# Altium schematic sheet Quad_DDS.SchDoc: Pounder
size 420 x 297 mm; Author: G.Kasprowicz; CompanyName: WUT ISE; DrawnBy: G.Kasprowicz; Organization: WUT ISE; Address1: PW ISE; Address2: Nowowiejska 15/19 00-665 Warsaw; Address3: gkasprow@gmail.com; DocumentNumber: 4; SheetNumber: 4; SheetTotal: 7; ModifiedBy: -; CheckedDate: -; Title2: Quad DDS & clocking; DivGrp: WUT ISE; Designer: G.Kasprowicz; ModifiedDate: -; ProjectName: Sensor Box
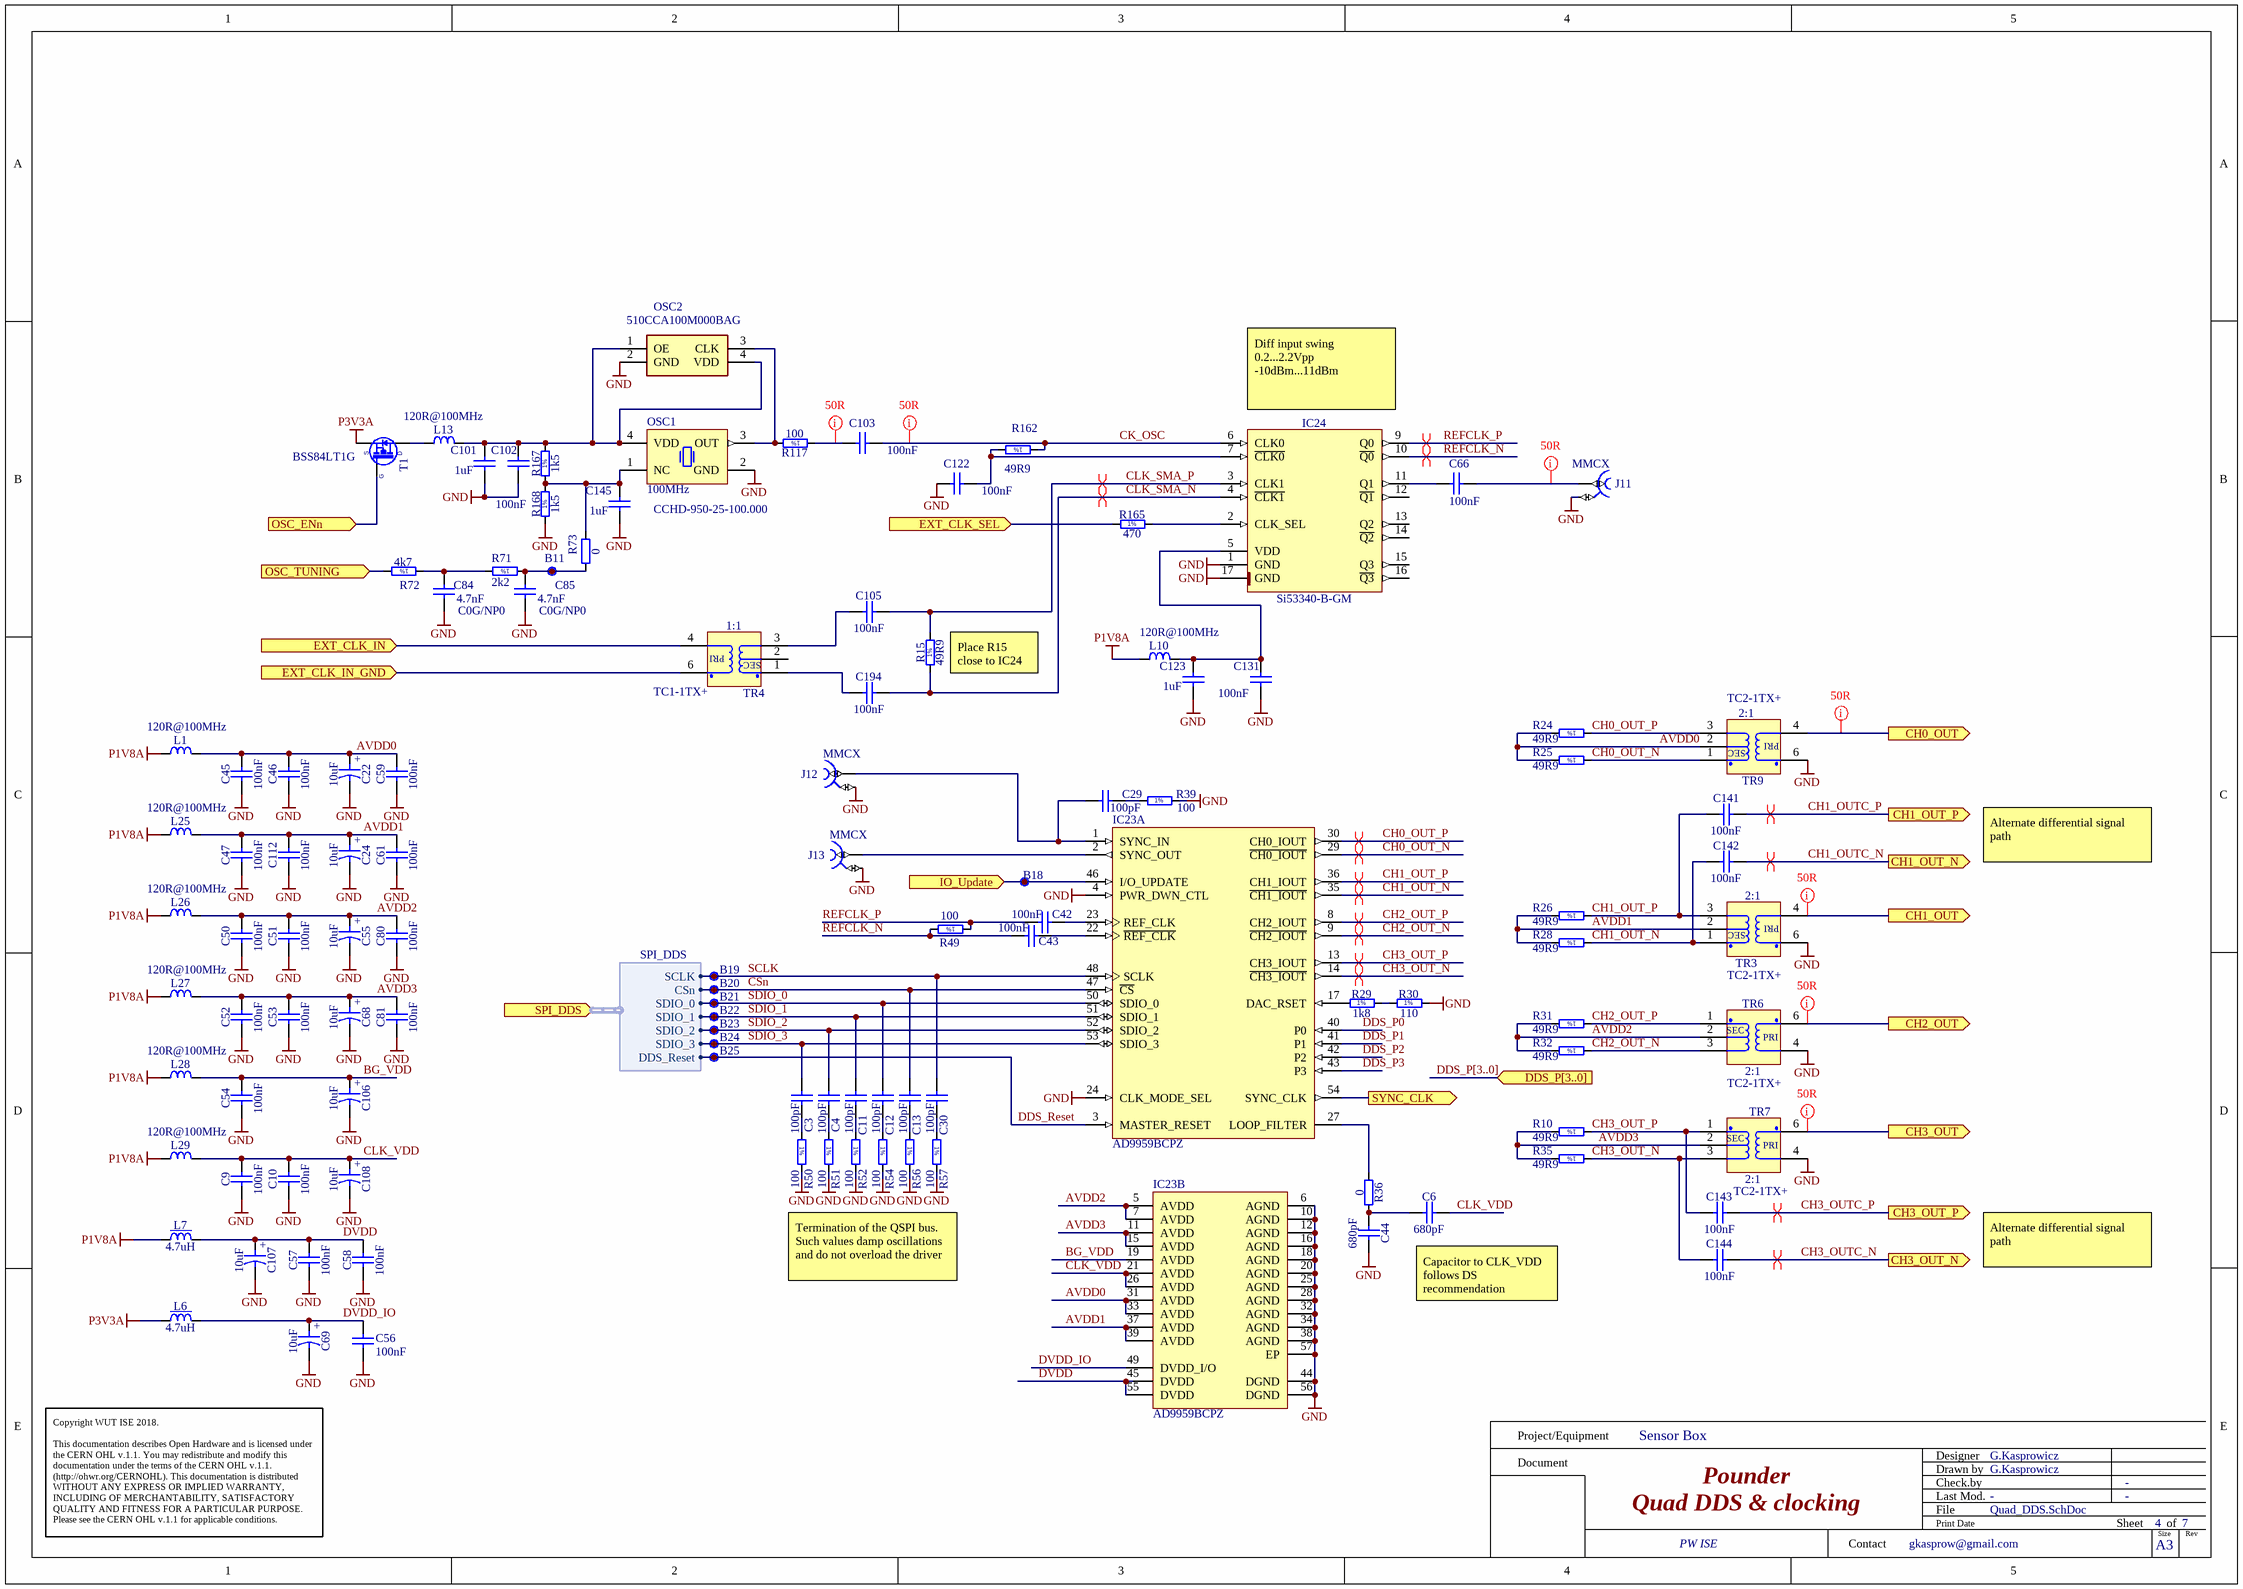
[diagram p0: Quad_DDS.SchDoc]

## Parts
B11  SMD Pad  [C100]  (value not drawn)
B18  SMD Pad  [C100]  (value not drawn)
B19  SMD Pad  [C100]  (value not drawn)
B20  SMD Pad  [C100]  (value not drawn)
B21  SMD Pad  [C100]  (value not drawn)
B22  SMD Pad  [C100]  (value not drawn)
B23  SMD Pad  [C100]  (value not drawn)
B24  SMD Pad  [C100]  (value not drawn)
B25  SMD Pad  [C100]  (value not drawn)
C3  100pF  [CAPC1005X55N]
C4  100pF  [CAPC1005X55N]
C6  680pF  [CAPC1608X87N]
C9  100nF  [CAPC1005X55N]
C10  100nF  [CAPC1005X55N]
C11  100pF  [CAPC1005X55N]
C12  100pF  [CAPC1005X55N]
C13  100pF  [CAPC1005X55N]
C22  10uF  [CAPMP3216X180N]
C24  10uF  [CAPMP3216X180N]
C29  100pF  [CAPC1005X55N]
C30  100pF  [CAPC1005X55N]
C42  100nF  [CAPC1005X55N]
C43  100nF  [CAPC1005X55N]
C44  680pF  [CAPC1608X87N]
C45  100nF  [CAPC1005X55N]
C46  100nF  [CAPC1005X55N]
C47  100nF  [CAPC1005X55N]
C50  100nF  [CAPC1005X55N]
C51  100nF  [CAPC1005X55N]
C52  100nF  [CAPC1005X55N]
C53  100nF  [CAPC1005X55N]
C54  100nF  [CAPC1005X55N]
C55  10uF  [CAPMP3216X180N]
C56  100nF  [CAPC1005X55N]
C57  100nF  [CAPC1005X55N]
C58  100nF  [CAPC1005X55N]
C59  100nF  [CAPC1005X55N]
C61  100nF  [CAPC1005X55N]
C66  100nF  [CAPC1005X55N]
C68  10uF  [CAPMP3216X180N]
C69  10uF  [CAPMP3216X180N]
C80  100nF  [CAPC1005X55N]
C81  100nF  [CAPC1005X55N]
C84  4.7nF  TC: C0G/NP0  [CAPC2012X95N]
C85  4.7nF  TC: C0G/NP0  [CAPC2012X95N]
C101  1uF  [CAPC1005X55N]
C102  100nF  [CAPC1005X55N]
C103  100nF  [CAPC1005X55N]
C105  100nF  [CAPC1005X55N]
C106  10uF  [CAPMP3216X180N]
C107  10uF  [CAPMP3216X180N]
C108  10uF  [CAPMP3216X180N]
C112  100nF  [CAPC1005X55N]
C122  100nF  [CAPC1005X55N]
C123  1uF  [CAPC1005X55N]
C131  100nF  [CAPC1005X55N]
C141  100nF  [CAPC1005X55N]
C142  100nF  [CAPC1005X55N]
C143  100nF  [CAPC1005X55N]
C144  100nF  [CAPC1005X55N]
C145  1uF  [CAPC1005X55N]
C194  100nF  [CAPC1005X55N]
IC23  AD9959BCPZ  [ADI-CP-56-1_M]  (parts A,B of 2)
IC24  Si53340-B-GM  [QFN50P300X300X90-17N-S175]
J11  MMCX  [Molex_73415-2063]
J12  MMCX  [Molex_73415-2063]
J13  MMCX  [Molex_73415-2063]
L1  120R@100MHz  [INDC1608X95N]
L6  4.7uH  [IND_WURTH_WE-TPC-2813]
L7  4.7uH  [IND_WURTH_WE-TPC-2813]
L10  120R@100MHz  [INDC1608X95N]
L13  120R@100MHz  [INDC1608X95N]
L25  120R@100MHz  [INDC1608X95N]
L26  120R@100MHz  [INDC1608X95N]
L27  120R@100MHz  [INDC1608X95N]
L28  120R@100MHz  [INDC1608X95N]
L29  120R@100MHz  [INDC1608X95N]
OSC1  100MHz  Manufacturer Part Number: CCHD-950-25-100.000  [OSC_CRYSTEK_CCHD-950]
OSC2  510CCA100M000BAG  [510CBA49M1520BAG]
R10  49R9  [RESC1005X40N]
R15  49R9  [RESC1005X40N]
R24  49R9  [RESC1005X40N]
R25  49R9  [RESC1005X40N]
R26  49R9  [RESC1005X40N]
R28  49R9  [RESC1005X40N]
R29  1k8  [RESC1608X55N]
R30  110  [RESC1005X40N]
R31  49R9  [RESC1005X40N]
R32  49R9  [RESC1005X40N]
R35  49R9  [RESC1005X40N]
R36  0  [RESC1608X55N]
R39  100  [RESC1005X40N]
R49  100  [RESC1005X40N]
R50  100  [RESC1005X40N]
R51  100  [RESC1005X40N]
R52  100  [RESC1005X40N]
R54  100  [RESC1005X40N]
R56  100  [RESC1005X40N]
R57  100  [RESC1005X40N]
R71  2k2  [RESC1608X55N]
R72  4k7  [RESC1608X55N]
R73  0  [RESC1608X55N]
R117  100  [RESC1005X40N]
R162  49R9  [RESC1005X40N]
R165  470  [RESC1005X40N]
R167  1k5  [RESC1608X55N]
R168  1k5  [RESC1608X55N]
T1  BSS84LT1G  [SOT95P240X110-3N]
TR3  2:1  Manufacturer Part Number: TC2-1TX+  [XFMR_MINI-CIRCUITS_AT1521]
TR4  1:1  Manufacturer Part Number: TC1-1TX+  [XFMR_MINI-CIRCUITS_AT1521]
TR6  2:1  Manufacturer Part Number: TC2-1TX+  [XFMR_MINI-CIRCUITS_AT1521]
TR7  2:1  Manufacturer Part Number: TC2-1TX+  [XFMR_MINI-CIRCUITS_AT1521]
TR9  2:1  Manufacturer Part Number: TC2-1TX+  [XFMR_MINI-CIRCUITS_AT1521]

## Ports
CH0_OUT (out), CH1_OUT (out), CH1_OUT_N (out), CH1_OUT_P (out), CH2_OUT (out), CH3_OUT (out), CH3_OUT_N (out), CH3_OUT_P (out), DDS_P[3..0] (in), EXT_CLK_IN (in), EXT_CLK_IN_GND (in), EXT_CLK_SEL (in), IO_Update (in), OSC_ENn (in), OSC_TUNING (in), SPI_DDS (in, harness SPI_DDS), SYNC_CLK (out)

## Harnesses
SPI_DDS: SCLK, CSn, SDIO_0, SDIO_1, SDIO_2, SDIO_3, DDS_Reset

## Nets
GND: C9.1 C10.1 C22.2 C24.2 C44.2 C45.1 C46.1 C47.1 C50.1 C51.1 C52.1 C53.1 C54.1 C55.2 C56.1 C57.1 C58.1 C59.1 C61.1 C68.2 C69.2 C80.1 C81.1 C84.1 C85.1 C101.1 C102.1 C106.2 C107.2 C108.2 C112.1 C122.2 C123.1 C131.1 C145.1 IC23.4(PWR_DWN_CTL) IC23.6(AGND) IC23.10(AGND) IC23.12(AGND) IC23.16(AGND) IC23.18(AGND) IC23.20(AGND) IC23.24(CLK_MODE_SEL) IC23.25(AGND) IC23.28(AGND) IC23.32(AGND) IC23.34(AGND) IC23.38(AGND) IC23.44(DGND) IC23.56(DGND) IC23.57(EP) IC24.1(GND) IC24.17(GND) J11.2 J12.2 J13.2 OSC1.2(GND) OSC2.2(GND) R30.2 R39.2 R50.2 R51.2 R52.2 R54.2 R56.2 R57.2 R168.1 TR3.6(PDOT) TR6.4(P) TR7.4(P) TR9.6(PDOT)
P1V8A: L1.2 L7.1 L10.2 L25.2 L26.2 L27.2 L28.2 L29.2
P3V3A: L6.1 T1.2(S)
AVDD0: C22.1 C45.2 C46.2 C59.2 IC23.31(AVDD) IC23.33(AVDD) L1.1 R24.2 R25.2 TR9.2(NC)
AVDD1: C24.1 C47.2 C61.2 C112.2 IC23.37(AVDD) IC23.39(AVDD) L25.1 R26.2 R28.2 TR3.2(NC)
AVDD2: C50.2 C51.2 C55.1 C80.2 IC23.5(AVDD) IC23.7(AVDD) L26.1 R31.2 R32.2 TR6.2(NC)
AVDD3: C52.2 C53.2 C68.1 C81.2 IC23.11(AVDD) IC23.15(AVDD) L27.1 R10.2 R35.2 TR7.2(NC)
BG_VDD: C54.2 C106.1 IC23.19(AVDD) L28.1
CH0_OUT: TR9.4(P) ; port CH0_OUT
CH0_OUT_N: IC23.29(~{CH0_IOUT}) R25.1 TR9.1(SDOT)
CH0_OUT_P: IC23.30(CH0_IOUT) R24.1 TR9.3(S)
CH1_OUT: TR3.4(P) ; port CH1_OUT
CH1_OUT_N: C142.1 IC23.35(~{CH1_IOUT}) R28.1 TR3.1(SDOT)
CH1_OUT_P: C141.1 IC23.36(CH1_IOUT) R26.1 TR3.3(S)
CH1_OUTC_N: C142.2 ; port CH1_OUT_N
CH1_OUTC_P: C141.2 ; port CH1_OUT_P
CH2_OUT: TR6.6(PDOT) ; port CH2_OUT
CH2_OUT_N: IC23.9(~{CH2_IOUT}) R32.1 TR6.3(S)
CH2_OUT_P: IC23.8(CH2_IOUT) R31.1 TR6.1(SDOT)
CH3_OUT: TR7.6(PDOT) ; port CH3_OUT
CH3_OUT_N: C144.1 IC23.14(~{CH3_IOUT}) R35.1 TR7.3(S)
CH3_OUT_P: C143.1 IC23.13(CH3_IOUT) R10.1 TR7.1(SDOT)
CH3_OUTC_N: C144.2 ; port CH3_OUT_N
CH3_OUTC_P: C143.2 ; port CH3_OUT_P
CK_OSC: C103.1 IC24.6(CLK0) R162.1
CLK_SMA_N: C194.2 IC24.4(~{CLK1}) R15.1
CLK_SMA_P: C105.2 IC24.3(CLK1) R15.2
CLK_VDD: C6.2 C9.2 C10.2 C108.1 IC23.21(AVDD) IC23.26(AVDD) L29.1
CSn: B20.1 C13.2 IC23.47(~{CS}) ; port SPI_DDS.CSn
DDS_P0: IC23.40(P0)
DDS_P1: IC23.41(P1)
DDS_P2: IC23.42(P2)
DDS_P3: IC23.43(P3)
DDS_Reset: B25.1 IC23.3(MASTER_RESET) ; port SPI_DDS.DDS_Reset
DVDD: C57.2 C58.2 C107.1 IC23.45(DVDD) IC23.55(DVDD) L7.2
DVDD_IO: C56.2 C69.1 IC23.49(DVDD_I/O) L6.2
EXT_CLK_IN: TR4.4(P) ; port EXT_CLK_IN
EXT_CLK_IN_GND: TR4.6(PDOT) ; port EXT_CLK_IN_GND
EXT_CLK_SEL: R165.1 ; port EXT_CLK_SEL
IO_Update: B18.1 IC23.46(I/O_UPDATE) ; port IO_Update
OSC_ENn: T1.1(G) ; port OSC_ENn
OSC_TUNING: R72.2 ; port OSC_TUNING
REFCLK_N: C43.2 IC24.10(~{Q0}) R49.2
REFCLK_P: C42.2 IC24.9(Q0) R49.1
SCLK: B19.1 C30.2 IC23.48(SCLK) ; port SPI_DDS.SCLK
SDIO_0: B21.1 C12.2 IC23.50(SDIO_0) ; port SPI_DDS.SDIO_0
SDIO_1: B22.1 C11.2 IC23.51(SDIO_1) ; port SPI_DDS.SDIO_1
SDIO_2: B23.1 C4.2 IC23.52(SDIO_2) ; port SPI_DDS.SDIO_2
SDIO_3: B24.1 C3.2 IC23.53(SDIO_3) ; port SPI_DDS.SDIO_3
SYNC_CLK: IC23.54(SYNC_CLK) ; port SYNC_CLK
NetB11_1: B11.1 C85.2 R71.1 R73.1
NetC3_1: C3.1 R50.1
NetC4_1: C4.1 R51.1
NetC6_1: C6.1 C44.1 R36.2
NetC11_1: C11.1 R52.1
NetC12_1: C12.1 R54.1
NetC13_1: C13.1 R56.1
NetC29_1: C29.1 R39.1
NetC29_2: C29.2 IC23.1(SYNC_IN) J12.1
NetC30_1: C30.1 R57.1
NetC42_1: C42.1 IC23.23(REF_CLK)
NetC43_1: C43.1 IC23.22(~{REF_CLK})
NetC66_1: C66.1 J11.1
NetC66_2: C66.2 IC24.11(Q1)
NetC84_2: C84.2 R71.2 R72.1
NetC101_2: C101.2 C102.2 L13.1 OSC1.4(VDD) OSC2.1(OE) OSC2.4(VDD) R167.2
NetC103_2: C103.2 R117.1
NetC105_1: C105.1 TR4.3(S)
NetC122_1: C122.1 IC24.7(~{CLK0}) R162.2
NetC123_2: C123.2 C131.2 IC24.5(VDD) L10.1
NetC145_2: C145.2 OSC1.1(NC) R73.2 R167.1 R168.2
NetC194_1: C194.1 TR4.1(SDOT)
NetIC23_2: IC23.2(SYNC_OUT) J13.1
NetIC23_17: IC23.17(DAC_RSET) R29.1
NetIC23_27: IC23.27(LOOP_FILTER) R36.1
NetIC24_2: IC24.2(CLK_SEL) R165.2
NetL13_2: L13.2 T1.3(D)
NetOSC1_3: OSC1.3(OUT) OSC2.3(CLK) R117.2
NetR29_2: R29.2 R30.1

Not connected (* = marked no-connect by the designer): IC24 12(~{Q1}) 13(Q2) 14(~{Q2}) 15(Q3) 16(~{Q3}); TR4 2(NC)

## Buses and harness runs
bus DDS_P[3..0] = port DDS_P[3..0]

## Layout directives
differential pair: CH0_OUT_N, CH0_OUT_P, CH1_OUT_N, CH1_OUT_P, CH1_OUTC_N, CH1_OUTC_P, CH2_OUT_N, CH2_OUT_P, CH3_OUT_N, CH3_OUT_P, CH3_OUTC_N, CH3_OUTC_P, CLK_SMA_N, CLK_SMA_P, REFCLK_N, REFCLK_P
net class Z50R: CH0_OUT, CH1_OUT, CH2_OUT, CH3_OUT, CK_OSC, NetC66_1, NetC103_2

## Notes on the sheet
- (near IC24) Diff input swing
  0.2...2.2Vpp
  -10dBm...11dBm
- (near R15) Place R15 close to IC24
- Alternate differential signal path
- Termination of the QSPI bus. Such values damp oscillations and do not overload the driver
- Capacitor to CLK_VDD follows DS recommendation
- Project/Equipment
- Document
- Designer
- Drawn by
- Check.by
- Copyright WUT ISE 2018.
  This documentation describes Open Hardware and is licensed under the CERN OHL v.1.1. You may redistribute and modify this documentation under the terms of the CERN OHL v.1.1. (http://ohwr.org/CERNOHL). This documentation is distributed WITHOUT ANY EXPRESS OR IMPLIED WARRANTY, INCLUDING OF MERCHANTABILITY, SATISFACTORY QUALITY AND FITNESS FOR A PARTICULAR PURPOSE. Please see the CERN OHL v.1.1 for applicable conditions.
- Contact
- File
- Last Mod.
- Print Date
- Sheet
- Size
- A3
- of
- Rev
- (in symbol CTE3216-18_10UF_16V_20%_AVX_TCJ) +
- (in symbol R0402_49R9_1%_0.0625W_100PPM) 1%
- (in symbol R0402_100R_1%_0.0625W_100PPM) 1%
- (in symbol R0402_110R_1%_0.0625W_100PPM) 1%
- (in symbol R0402_470R_1%_0.0625W_100PPM) 1%
- (in symbol R0603_1K5_1%_0.1W_100PPM) 1%
- (in symbol R0603_1K8_1%_0.1W_100PPM) 1%
- (in symbol R0603_2K2_1%_0.1W_100PPM) 1%
- (in symbol R0603_4K7_1%_0.1W_100PPM) 1%
- (in symbol XFMR_MINI-CIRCUITS_TC1-1TX+) PRI; SEC
- (in symbol XFMR_MINI-CIRCUITS_TC2-1TX+) PRI; SEC

## Library data of the parts
B11 B18-B25 = SMD_PAD_D1MM: Through Hole Pad; Part Description: 1mm Diameter SMD Pad; Mounted: No; Part Number: SMD_PAD_D1MM; Component Kind: Standard (No BOM); Component Type: Standard (No BOM); Pin Count: 1; Family: SMD Pad; Socket: No; SMD: No; Sense: No; Status: None; ComponentHeight: 0mm; HelpURL: Undefined; Author: CERN DEM JLC; CreateDate: 10.10.2017; LatestRevisionDate: 10.10.2017; PackageDescription: 1mm Diameter SMD Pad
C3 C4 C11-C13 C29 C30 = CC0402_100PF_50V_5%_C0G: Non-polarised capacitor; Part Description: SMD Multilayer Chip Ceramic Capacitor; Manufacturer: GENERIC; Manufacturer1 Part Number: C0402C101J5GACTU; Voltage: 50V; TC: C0G/NP0; Tolerance: ±5%; Part Number: CC0402_100PF_50V_5%_C0G; Component Kind: Standard; Component Type: Standard; Pin Count: 2; Value: 100pF; Status: Preferred; Manufacturer Part Number: CC0402_100PF_50V_5%_C0G; Case: 0402; Mounted: Yes; Socket: No; SMD: Yes; Sense: No; Manufacturer1 Example: KEMET; Manufacturer1 ComponentHeight: 0.55mm; HelpURL: \\cern.ch\dfs\Applications\Altium\Datasheets\CC0805_C0G_KEMET_(Commercial Grade).pdf; Author: CERN DEM JLC; CreateDate: 03.12.2007; LatestRevisionDate: 22.04.2015
C6 C44 = CC0603_680PF_50V_5%_NP0: Non-polarised capacitor; Part Description: SMD Multilayer Chip Ceramic Capacitor; Manufacturer: GENERIC; Manufacturer1 Part Number: 223886715681; Voltage: 50V; TC: C0G/NP0; Tolerance: ±5%; Part Number: CC0603_680PF_50V_5%_NP0; Component Kind: Standard; Component Type: Standard; Pin Count: 2; Value: 680pF; Status: Preferred; Manufacturer Part Number: CC0603_680PF_50V_5%_NP0; Case: 0603; Mounted: Yes; Socket: No; SMD: Yes; Sense: No; Manufacturer1 ComponentHeight: 0.87mm; HelpURL: \\cern.ch\dfs\Applications\Altium\Datasheets\CC0603_NP0_PHYCOMP.pdf; Author: CERN DEM JLC; CreateDate: 03.12.2007; LatestRevisionDate: 03.12.2007; Manufacturer1 Example: PHYCOMP
C9 C10 C42 C43 C45-C47 C50-C54 C56-C59 C61 C66 C80 C81 C102 C103 C105 C112 C122 C131 C141-C144 C194 = CC0402_100NF_16V_10%_X5R: Non-polarised capacitor; Part Description: SMD Multilayer Chip Ceramic Capacitor; Manufacturer: GENERIC; Manufacturer1 Part Number: GRM155R61C104KA88D; Voltage: 16V; TC: X5R; Tolerance: ±10%; Part Number: CC0402_100NF_16V_10%_X5R; Component Kind: Standard; Component Type: Standard; Pin Count: 2; Value: 100nF; Status: None; Manufacturer Part Number: CC0402_100NF_16V_10%_X5R; Case: 0402; Mounted: Yes; Socket: No; SMD: Yes; Sense: No; Manufacturer1 Example: MURATA; Manufacturer1 ComponentHeight: 0.55mm; HelpURL: \\cern.ch\dfs\Applications\Altium\Datasheets\CC0402_X5R_MURATA_GRM.pdf; Author: CERN DEM JLC; CreateDate: 10.12.2013; LatestRevisionDate: 10.12.2013
C22 C24 C55 C68 C69 C106-C108 = CTE3216-18_10UF_16V_20%_AVX_TCJ: Polarised capacitor; Part Description: ESR 0R200 Tantalum Solid Electrolytic Chip Capacitor with Conductive Polymer Electrode; Manufacturer: AVX; Manufacturer Part Number: TCJA106M016R0200; Voltage: 16V; Tolerance: ±20%; Part Number: CTE3216-18_10UF_16V_20%_AVX_TCJ; Component Kind: Standard; Component Type: Standard; Pin Count: 2; Value: 10uF; Status: Preferred; Case: A; Mounted: Yes; Socket: No; SMD: Yes; Sense: No; ComponentHeight: 1.8mm; HelpURL: \\cern.ch\dfs\Applications\Altium\Datasheets\CTE_AVX_TCJ.pdf; Author: CERN DEM JLC; CreateDate: 29.03.2012; LatestRevisionDate: 29.03.2012
C84 C85 = CC0805_4.7NF_50V_5%_NP0: Non-polarised capacitor; Part Description: SMD Multilayer Chip Ceramic Capacitor; Manufacturer: GENERIC; Manufacturer1 Part Number: GRM2195C1H472JA01; Voltage: 50V; Tolerance: ±5%; Part Number: CC0805_4.7NF_50V_5%_NP0; Component Kind: Standard; Component Type: Standard; Pin Count: 2; Value: 4.7nF; Status: None; Manufacturer Part Number: CC0805_4.7NF_50V_5%_NP0; Case: 0805; Mounted: Yes; Socket: No; SMD: Yes; Sense: No; Manufacturer1 Example: MURATA; Manufacturer1 ComponentHeight: 0.95mm; HelpURL: \\cern.ch\dfs\Applications\Altium\Datasheets\CC0805_MURATA_GRM2195C1H472JA01.pdf; Author: CERN DEM MR; CreateDate: 30.03.2016; LatestRevisionDate: 30.03.2016
C101 C123 C145 = CC0402_1UF_16V_10%_X5R: Non-polarised capacitor; Part Description: SMD Multilayer Chip Ceramic Capacitor; Manufacturer: GENERIC; Manufacturer1 Part Number: C1005X5R1C105KT; Voltage: 16V; TC: X5R; Tolerance: ±10%; Part Number: CC0402_1UF_16V_10%_X5R; Component Kind: Standard; Component Type: Standard; Pin Count: 2; Value: 1uF; Status: Preferred; Manufacturer Part Number: CC0402_1UF_16V_10%_X5R; Case: 0402; Mounted: Yes; Socket: No; SMD: Yes; Sense: No; Manufacturer1 Example: TDK; Manufacturer1 ComponentHeight: 0.55mm; HelpURL: \\cern.ch\dfs\Applications\Altium\Datasheets\CC0402_X5R_TDK_C.pdf; Author: CERN DEM JLC; CreateDate: 2012-10-25; LatestRevisionDate: 2012-10-25
IC23 = CMP-0293-00014-1: 4-Channel, 500 MSPS DDS with 10-Bit DACs, Serial, CP-56-1, 260 Tray, Pb-Free; Tuning Word Width (bits): 32bit; Master fclk: 500MHz; Compliance Range (V): 2.3V; FS Iout (mA nom): 10mA; REFCLK Multiplier: Yes; I Supply total (max): 180mA; Resolution (Bits): 10bit; ComponentLink3URL: http://www.analog.com/static/imported-files/packages/32698137492825CP_56_1.pdf; PackageDescription: 56-Lead Lead Frame Chip Scale Package [LFCSP_VQ]; DatasheetVersion: Rev. B; ComponentLink1URL: www.analog.com; PackageVersion: 112805-0; ComponentLink1Description: Manufacturer URL; ComponentLink2Description: Datasheet; Code_JEDEC: MO-220-VLLD-2; ComponentLink2URL: http://www.analog.com/static/imported-files/data_sheets/AD9959.pdf; PackageReference: CP-56-1; I/O Interface: Serial; ComponentLink3Description: Package Specification
IC24 = Si53340-B-GM: Low-Jitter LVDS Fanout Clock Buffers, 10-Output,  Any-Input, Any-Frequency up to 1250MHz; Manufacturer: SILICON LABS; PressFit: No; Bonding: No; Part Number: Si53340-B-GM; Component Kind: Standard; Component Type: Standard; Device: Si53340-B-GM; PackageDescription: QFN, 0.50mm Pitch, Square; 16 Pin, 3.00mm L X 3.00mm W X 0.90mm H Body (w/thermal tab 1.75mm x 1.75mm), IPC Medium Density; Part Description: Low-Jitter LVDS Fanout Clock Buffers, 10-Output,  Any-Input, Any-Frequency up to 1250MHz; Manufacturer Part Number: Si53340-B-GM; Pin Count: 17; Case: QFN16; Mounted: Yes; Socket: No; SMD: Yes; Sense: No; ComponentHeight: 0.9mm; HelpURL: \\cern.ch\dfs\Applications\Altium\Datasheets\Si53340-B-GM.pdf; Author: CERN DEM MR; CreateDate: 04.09.2017; LatestRevisionDate: 04.09.2017
J11-J13 = CON_RF_MMCX_SMT: SMT MMCX connector; Part Description: Straight Through-hole 50 Ohm Micro Mini RF Jack, MMCX Series; Manufacturer: Molex; Manufacturer Part Number: 73415-2063; PressFit: No; Component Kind: Standard; Component Type: Standard; Pin Count: 2; Mounted: Yes; Socket: No; Sense: No; SMD: No; Status: None; ComponentHeight: 4.35mm; HelpURL: \\cern.ch\dfs\Applications\Altium\Datasheets\SAMTEC_MMCX-J-P-H-ST-TH1.pdf; Author: GK; CreateDate: 05.12.2012; LatestRevisionDate: 05.12.2012; Part Number: 73415-2063
L1 L10 L13 L25-L29 = IND0603_MURATA_BLM18PG121SN1D: Inductor; Part Description: SMD EMIFIL Chip Ferrite Bead; Manufacturer: MURATA; Power: 2A; Resistance: 0.05R; Part Number: IND0603_MURATA_BLM18PG121SN1D; Component Kind: Standard; Component Type: Standard; Pin Count: 2; Value: 120R@100MHz; Status: None; Manufacturer Part Number: BLM18PG121SN1D; Case: 0603; Mounted: Yes; Socket: No; SMD: Yes; Sense: No; ComponentHeight: 0.95mm; HelpURL: \\cern.ch\dfs\Applications\Altium\Datasheets\IND0603_MURATA_BLM18P.pdf; Author: CERN DEM BC; CreateDate: 2015-07-27; LatestRevisionDate: 2015-07-27
L6 L7 = IND_4.7UH_30%_WURTH_WE-TPC_744029004: Inductor With Core; Part Description: Shielded Tiny Power Inductor (WE-TPC Series); Manufacturer: WURTH ELEKTRONIK; Power: 1A; Resistance: 0.017R; Tolerance: ±30%; Part Number: IND_4.7UH_30%_WURTH_WE-TPC_744029004; Component Kind: Standard; Component Type: Standard; Pin Count: 2; Value: 4.7uH; Status: None; Manufacturer Part Number: 744029004; Mounted: Yes; Socket: No; SMD: Yes; Sense: No; ComponentHeight: 3mm; HelpURL: \\cern.ch\dfs\Applications\Altium\Datasheets\IND_WURTH_WE-TPC_744029004.pdf; Author: CERN DEM JLC; CreateDate: 20.11.2014; LatestRevisionDate: 20.11.2014
OSC1 = OSC_CCHD-950: 100MHz low noise oscillator; Part Number: OSC_100MHZ_CRYSTEK_CCHD-950-25-100.000; Part Description: 3.3V, ±25ppm, 0..70°C, CMOS Surface Mount Ultra-Low Noise Oscillator (CCHD-950 Series); Manufacturer: CRYSTEK CRYSTAL; PressFit: No; Bonding: No; Component Kind: Standard; Component Type: Standard; PackageDescription: Oscillator, 5.08mm Pitch; 4 Pin, 14.2mm L X 9.14mm W X 5.3mm H, CCHD-950 Serie; Value: 100MHz; Pin Count: 4; Mounted: Yes; Socket: No; SMD: Yes; Sense: No; ComponentHeight: 5.3mm; HelpURL: \\cern.ch\dfs\Applications\Altium\Datasheets\OSC_CRYSTEK_CVHD-950.pdf; Author: GK; CreateDate: 04.11.2016; LatestRevisionDate: 04.11.2016
OSC2 = 510CCA100M000BAG: Crystal or Oscillator; Manufacturer_Name: Silicon Labs; Datasheet Link: https://www.silabs.com/documents/public/data-sheets/si510-11.pdf; Height: 1mm; Manufacturer_Part_Number: 510CCA100M000BAG; Mouser Part Number: 634-510CCA100M000BAG; Mouser Price/Stock: https://www.mouser.com/Search/Refine.aspx?Keyword=634-510CCA100M000BAG
R10 R15 R24-R26 R28 R31 R32 R35 R162 = R0402_49R9_1%_0.0625W_100PPM: Resistor - 1%; Part Description: General Purpose Thick Film Chip Resistor; Manufacturer: GENERIC; Manufacturer1 Part Number: 232270674999L or RC0402FR-0749R9L; TC: ±100ppm/°C; PressFit: No; Part Number: R0402_49R9_1%_0.0625W_100PPM; Component Kind: Standard; Component Type: Standard; Pin Count: 2; Value: 49R9; Status: Not Recommended; Power: 0.0625W; Tolerance: ±1%; Manufacturer Part Number: R0402_49R9_1%_0.0625W_100PPM; Case: 0402; Mounted: Yes; Sense: No; Socket: No; SMD: Yes; Manufacturer1 Example: YAGEO PHYCOMP; Manufacturer1 ComponentHeight: 0.4mm; HelpURL: \\cern.ch\dfs\Applications\Altium\Datasheets\R0402_Phycomp_RC0402.pdf; Author: CERN DEM JLC; CreateDate: 24.10.2012; LatestRevisionDate: 24.10.2012
R29 = R0603_1K8_1%_0.1W_100PPM: Resistor - 1%; Part Description: General Purpose Thick Film Chip Resistor; Manufacturer: GENERIC; Manufacturer1 Part Number: NRC06F1801TRF; Power: 0.1W; TC: ±100ppm/°C; PressFit: No; Part Number: R0603_1K8_1%_0.1W_100PPM; Component Kind: Standard; Component Type: Standard; Pin Count: 2; Value: 1k8; Status: Preferred; Tolerance: ±1%; Manufacturer Part Number: R0603_1K8_1%_0.1W_100PPM; Case: 0603; Mounted: Yes; Sense: No; Socket: No; SMD: Yes; Manufacturer1 Example: NIC COMPONENT; Manufacturer1 ComponentHeight: 0.55mm; HelpURL: \\cern.ch\dfs\Applications\Altium\Datasheets\R0603_NIC_NRC.pdf; Author: CERN DEM JLC; CreateDate: 03.12.2007; LatestRevisionDate: 13.03.2008
R30 = R0402_110R_1%_0.0625W_100PPM: Resistor - 1%; Part Description: General Purpose Thick Film Chip Resistor; Manufacturer: GENERIC; Manufacturer1 Part Number: 232270671101L; TC: ±100ppm/°C; PressFit: No; Part Number: R0402_110R_1%_0.0625W_100PPM; Component Kind: Standard; Component Type: Standard; Pin Count: 2; Value: 110; Status: Not Recommended; Power: 0.0625W; Tolerance: ±1%; Manufacturer Part Number: R0402_110R_1%_0.0625W_100PPM; Case: 0402; Mounted: Yes; Sense: No; Socket: No; SMD: Yes; Manufacturer1 Example: YAGEO PHYCOMP; Manufacturer1 ComponentHeight: 0.4mm; HelpURL: \\cern.ch\dfs\Applications\Altium\Datasheets\R0402_Phycomp_RC0402.pdf; Author: CERN DEM JLC; CreateDate: 03.12.2007; LatestRevisionDate: 17.10.2012
R36 R73 = R0603_0R_JUMPER: Resistor; Part Description: 1A (0.05R Max DC Resistance) Zero Ohm Jumper; Manufacturer: GENERIC; Manufacturer1 Part Number: NRC06Z0; PressFit: No; Part Number: R0603_0R_JUMPER; Component Kind: Standard; Component Type: Standard; Pin Count: 2; Value: 0; Status: Preferred; Manufacturer Part Number: R0603_0R_JUMPER; Case: 0603; Mounted: Yes; Sense: No; Socket: No; SMD: Yes; Manufacturer1 Example: NIC COMPONENT; Manufacturer1 ComponentHeight: 0.55mm; HelpURL: \\cern.ch\dfs\Applications\Altium\Datasheets\R0603_NIC_NRC.pdf; Author: CERN DEM JLC; CreateDate: 03/12/2007; LatestRevisionDate: 13/03/2008
R39 R49-R52 R54 R56 R57 R117 = R0402_100R_1%_0.0625W_100PPM: Resistor - 1%; Part Description: General Purpose Thick Film Chip Resistor; Manufacturer: GENERIC; Manufacturer1 Part Number: 232270671001L; TC: ±100ppm/°C; PressFit: No; Part Number: R0402_100R_1%_0.0625W_100PPM; Component Kind: Standard; Component Type: Standard; Pin Count: 2; Value: 100; Status: Not Recommended; Power: 0.0625W; Tolerance: ±1%; Manufacturer Part Number: R0402_100R_1%_0.0625W_100PPM; Case: 0402; Mounted: Yes; Sense: No; Socket: No; SMD: Yes; Manufacturer1 Example: YAGEO PHYCOMP; Manufacturer1 ComponentHeight: 0.4mm; HelpURL: \\cern.ch\dfs\Applications\Altium\Datasheets\R0402_Phycomp_RC0402.pdf; Author: CERN DEM JLC; CreateDate: 03.12.2007; LatestRevisionDate: 17.10.2012
R71 = R0603_2K2_1%_0.1W_100PPM: Resistor - 1%; Part Description: General Purpose Thick Film Chip Resistor; Manufacturer: GENERIC; Manufacturer1 Part Number: NRC06F2201TRF; Power: 0.1W; TC: ±100ppm/°C; Part Number: R0603_2K2_1%_0.1W_100PPM; Component Kind: Standard; Component Type: Standard; Pin Count: 2; Value: 2k2; Status: Preferred; Tolerance: ±1%; Manufacturer Part Number: R0603_2K2_1%_0.1W_100PPM; Case: 0603; Mounted: Yes; Sense: No; Socket: No; SMD: Yes; Manufacturer1 Example: NIC COMPONENT; Manufacturer1 ComponentHeight: 0.55mm; HelpURL: \\cern.ch\dfs\Applications\Altium\Datasheets\R0603_NIC_NRC.pdf; Author: CERN DEM JLC; CreateDate: 03.12.2007; LatestRevisionDate: 13.03.2008
R72 = R0603_4K7_1%_0.1W_100PPM: Resistor - 1%; Part Description: General Purpose Thick Film Chip Resistor; Manufacturer: GENERIC; Manufacturer1 Part Number: NRC06F4701TRF; Power: 0.1W; TC: ±100ppm/°C; PressFit: No; Part Number: R0603_4K7_1%_0.1W_100PPM; Component Kind: Standard; Component Type: Standard; Pin Count: 2; Value: 4k7; Status: Preferred; Tolerance: ±1%; Manufacturer Part Number: R0603_4K7_1%_0.1W_100PPM; Case: 0603; Mounted: Yes; Sense: No; Socket: No; SMD: Yes; Manufacturer1 Example: NIC COMPONENT; Manufacturer1 ComponentHeight: 0.55mm; HelpURL: \\cern.ch\dfs\Applications\Altium\Datasheets\R0603_NIC_NRC.pdf; Author: CERN DEM JLC; CreateDate: 03.12.2007; LatestRevisionDate: 13.03.2008
R165 = R0402_470R_1%_0.0625W_100PPM: Resistor - 1%; Part Description: General Purpose Thick Film Chip Resistor; Manufacturer: GENERIC; Manufacturer1 Part Number: 232270674701L; TC: ±100ppm/°C; PressFit: No; Part Number: R0402_470R_1%_0.0625W_100PPM; Component Kind: Standard; Component Type: Standard; Pin Count: 2; Value: 470; Status: Not Recommended; Power: 0.0625W; Tolerance: ±1%; Manufacturer Part Number: R0402_470R_1%_0.0625W_100PPM; Case: 0402; Mounted: Yes; Sense: No; Socket: No; SMD: Yes; Manufacturer1 Example: YAGEO PHYCOMP; Manufacturer1 ComponentHeight: 0.4mm; HelpURL: \\cern.ch\dfs\Applications\Altium\Datasheets\R0402_Phycomp_RC0402.pdf; Author: CERN DEM JLC; CreateDate: 03.12.2007; LatestRevisionDate: 17.10.2012
R167 R168 = R0603_1K5_1%_0.1W_100PPM: Resistor - 1%; Part Description: General Purpose Thick Film Chip Resistor; Manufacturer: GENERIC; Manufacturer1 Part Number: NRC06F1501TRF; Power: 0.1W; TC: ±100ppm/°C; PressFit: No; Part Number: R0603_1K5_1%_0.1W_100PPM; Component Kind: Standard; Component Type: Standard; Pin Count: 2; Value: 1k5; Status: Preferred; Tolerance: ±1%; Manufacturer Part Number: R0603_1K5_1%_0.1W_100PPM; Case: 0603; Mounted: Yes; Sense: No; Socket: No; SMD: Yes; Manufacturer1 Example: NIC COMPONENT; Manufacturer1 ComponentHeight: 0.55mm; HelpURL: \\cern.ch\dfs\Applications\Altium\Datasheets\R0603_NIC_NRC.pdf; Author: CERN DEM JLC; CreateDate: 03.12.2007; LatestRevisionDate: 13.03.2008
T1 = BSS84LT1G: P-CHANNEL MOSFET WITH DIODE; Part Description: 50V 130mA Single P-Channel Power MOSFET; Manufacturer: ON SEMICONDUCTOR; PressFit: No; Bonding: No; Part Number: BSS84LT1G; Component Kind: Standard; Component Type: Standard; Device: BSS84LT1G; PackageDescription: SOT23 3-Leads, Pitch 0.95mm - Body 1.4x3mm, IPC Medium Density; Manufacturer Part Number: BSS84LT1G; Pin Count: 3; Case: SOT23-3; Mounted: Yes; Socket: No; SMD: Yes; Sense: No; ComponentHeight: 1.1mm; HelpURL: \\cern.ch\dfs\Applications\Altium\Datasheets\BSS84LT1G.pdf; Author: CERN DEM JLC; CreateDate: 29.03.2012; LatestRevisionDate: 29.03.2012
TR3 TR6 TR7 TR9 = XFMR_MINI-CIRCUITS_TC2-1TX+: 50 Ohms 3 to 300MHz RF Transformer; Part Number: XFMR_MINI-CIRCUITS_TC2-1TX+; Component Kind: Standard; Component Type: Standard; Pin Count: 5; Value: 2:1; Status: None; Manufacturer: MINI-CIRCUITS; Mounted: Yes; Socket: No; Sense: No; SMD: Yes; ComponentHeight: 4.06mm; HelpURL: \\cern.ch\dfs\Applications\Altium\Datasheets\XFMR_MINI-CIRCUITS_TC2-1TX+.pdf; Author: GK; CreateDate: 18.10.2019; LatestRevisionDate: 18.10.2019; Part Description: 50 Ohms 3 to 300MHz RF Transformer
TR4 = XFMR_MINI-CIRCUITS_TC1-1TX+: 50 Ohms 3 to 300MHz RF Transformer; Part Description: 50 Ohms 0.4 to 500MHz RF Transformer; Part Number: XFMR_MINI-CIRCUITS_TC1-1TX+; Component Kind: Standard; Component Type: Standard; Pin Count: 5; Value: 1:1; Status: None; Manufacturer: MINI-CIRCUITS; Mounted: Yes; Socket: No; Sense: No; SMD: Yes; ComponentHeight: 4.06mm; HelpURL: \\cern.ch\dfs\Applications\Altium\Datasheets\XFMR_MINI-CIRCUITS_TC2-1TX+.pdf; Author: GK; CreateDate: 05.01.2020; LatestRevisionDate: 05.01.2020